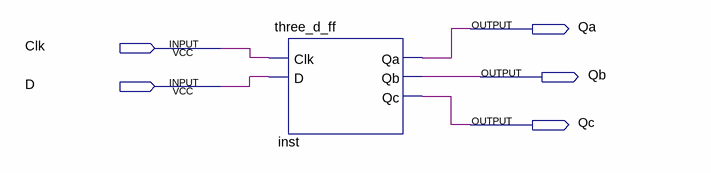
[diagram p0: schematic sheet]
// Quartus schematic 3dFlipFlop.bdf as structural Verilog: 1 symbols, 5 pins
module \3dFlipFlop  (
  input  Clk,
  input  D,
  output Qa,
  output Qb,
  output Qc
);

  three_d_ff inst (.Clk(Clk), .D(D), .Qa(Qa), .Qb(Qb), .Qc(Qc));
endmodule
